# Altium schematic sheet LEM.SchDoc: QUTMS - HVBoard - LEM
size A4; DocumentNumber: 4; SheetNumber: 4; SheetTotal: 5
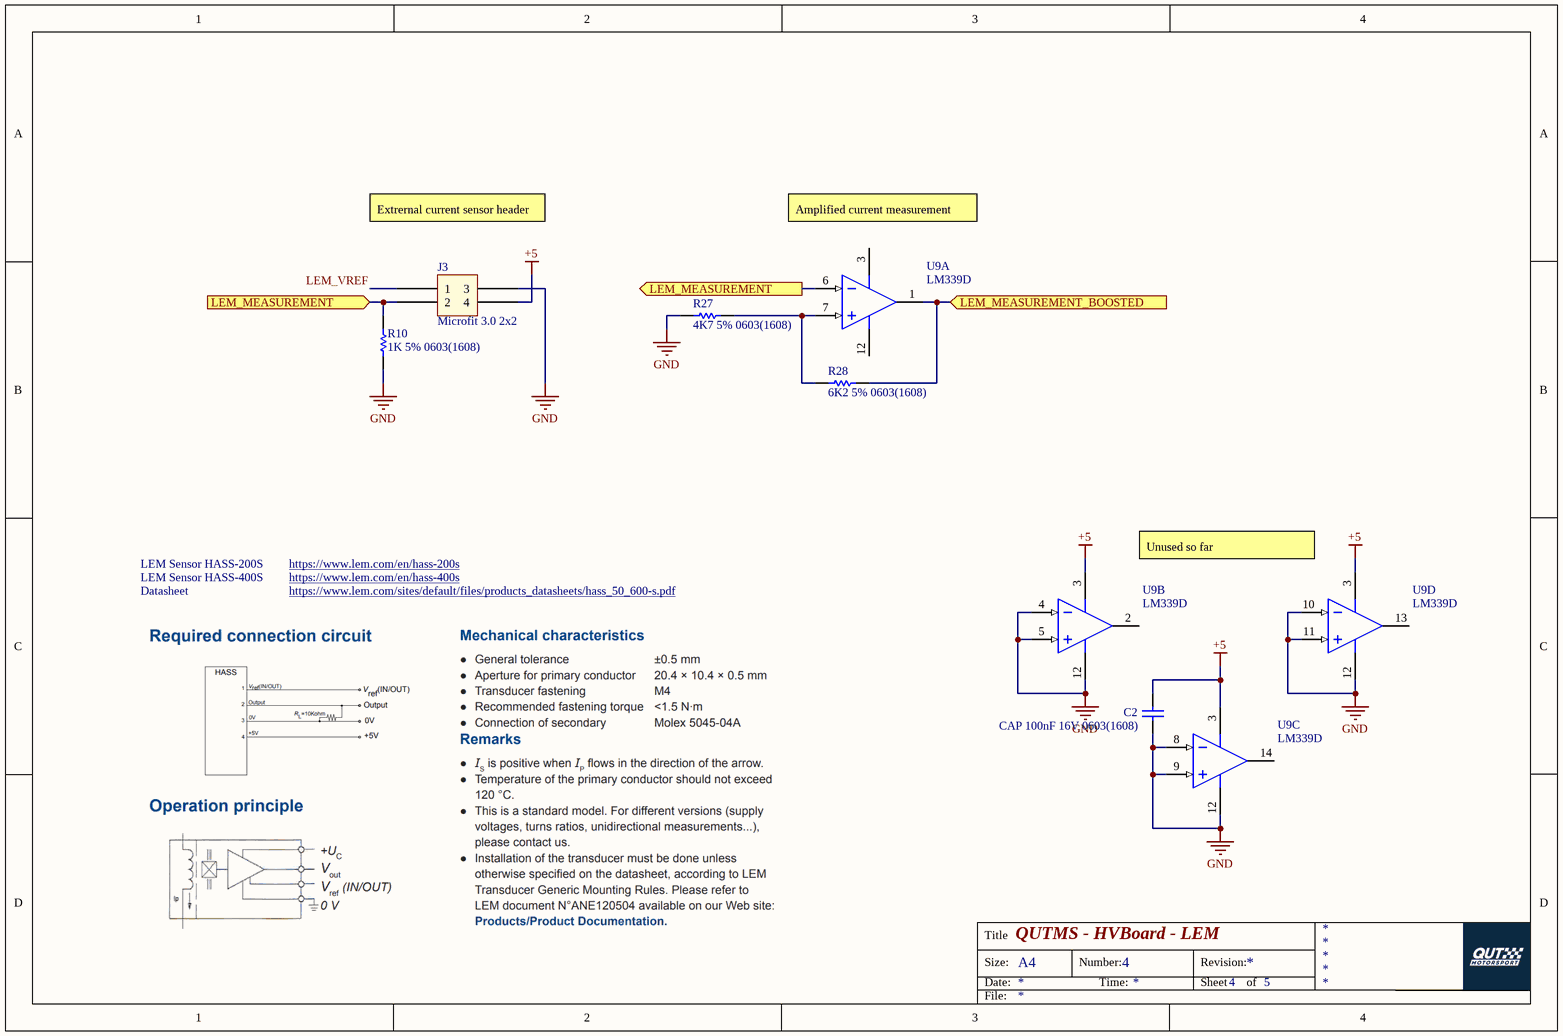
[diagram p0: LEM.SchDoc]

## Parts
C2  CAP 100nF 16V 0603(1608)  [CAPC0603(1608)100_N]
J3  Microfit 3.0 2x2  [Microfit_2X2_R_TH]
R10  1K 5% 0603(1608)  [RESC0603(1608)_L]
R27  4K7 5% 0603(1608)  [RESC0603(1608)_N]
R28  6K2 5% 0603(1608)  [RESC0603(1608)_L]
U9  LM339D  [D0014A_L]  (parts A,B,C,D of 4)

## Ports
LEM_MEASUREMENT (in), LEM_MEASUREMENT (out), LEM_MEASUREMENT_BOOSTED (in)

## Nets
+5: C2.2 J3.4 U9.3(VCC)
GND: C2.1 J3.3 R10.1 R27.2 U9.4(IN2-) U9.5(IN2+) U9.8(IN3-) U9.9(IN3+) U9.10(IN4-) U9.11(IN4+) U9.12(GND)
LEM_MEASUREMENT: J3.2 R10.2 U9.6(IN1-) ; port LEM_MEASUREMENT
LEM_MEASUREMENT_BOOSTED: R28.2 U9.1(OUT1) ; port LEM_MEASUREMENT_BOOSTED
LEM_VREF: J3.1
NetR27_1: R27.1 R28.1 U9.7(IN1+)

Not connected (* = marked no-connect by the designer): U9 2(OUT2) 13(OUT4) 14(OUT3)

## Notes on the sheet
- Extrernal current sensor header
- Amplified current measurement
- LEM Sensor HASS-400S
- LEM Sensor HASS-200S
- https://www.lem.com/en/hass-400s
- https://www.lem.com/en/hass-200s
- (near U9) Unused so far
- Datasheet
- https://www.lem.com/sites/default/files/products_datasheets/hass_50_600-s.pdf
- Title
- Size:
- Date:
- A4
- Number:
- Time:
- Revision:
- Sheet
- of
- File:

## Library data of the parts
C2 = CMP-1035-02584-1: CAP 100nF 16V ±10% 0603 (1608 Metric) Thickness 1mm SMD; Tolerance: Â±10%; Case-EIA: 0603; Case-Metric: 1608; Technology: SMT; Max Thickness: 1 mm; Value: 100nF; Rated Voltage: 16 V
J3 = Microfit_2x2
R10 = CMP-1012-00074-1: 1K 0.1W 5% 0603 (1608 Metric)  SMD; Case-EIA: 0603; Case-Metric: 1608; Value: 1000.00 Ohm; Technology: SMT; Tolerance: 5 %; Power: 0.1 W
R27 = CMP-1012-00090-1: 4K7 0.1W 5% 0603 (1608 Metric)  SMD; Case-Metric: 1608; Value: 4700.00 Ohm; Case-EIA: 0603; Tolerance: 5 %; Technology: SMT; Power: 0.1 W
R28 = CMP-1012-00093-1: 6K2 0.1W 5% 0603 (1608 Metric)  SMD; Case-Metric: 1608; Value: 6200.00 Ohm; Case-EIA: 0603; Tolerance: 5 %; Power: 0.1 W; Technology: SMT
U9 = CMP-2000-06548-1: Quad Differential Comparator, 2 to 30 V, 0 to 70 degC, 14-pin SOIC (D14), Green (RoHS & no Sb/Br), Tube; Manufacturer: Texas Instruments; Response Time: 300ns; No. of Comparators: 4; Package Version: 4040047-5/M, 06/2011; IC Output Type: CMOS,MOS,TTL; No. of Pins: 14Pins; Supply Voltage Range: 2Vto36V,±1Vto±18V; Product Range: -; Mounting Technology: SurfaceMount; Operating Temperature Min: 0°C; Package URL: http://www.ti.com/lit/ml/mpds177g/mpds177g.pdf; Automotive Qualification Standard: -; Package Description: 14-Pin Small Outline Integrated Circuit, Body 8.65 x 3.9 mm, Pitch 1.27 mm; Comparator Type: Differential; Manufacturer URL: http://www.ti.com/; Comparator Case Style: SOIC; Packaging: CutTape; Package Reference: D14; Datasheet URL: http://www.ti.com/general/docs/lit/getliterature.tsp?genericPartNumber=LM339&fileType=pdf; Datasheet Version: Rev. T, 06/2015; Operating Temperature Max: 70°C